# Altium schematic sheet 01_Overview.SchDoc
size A4
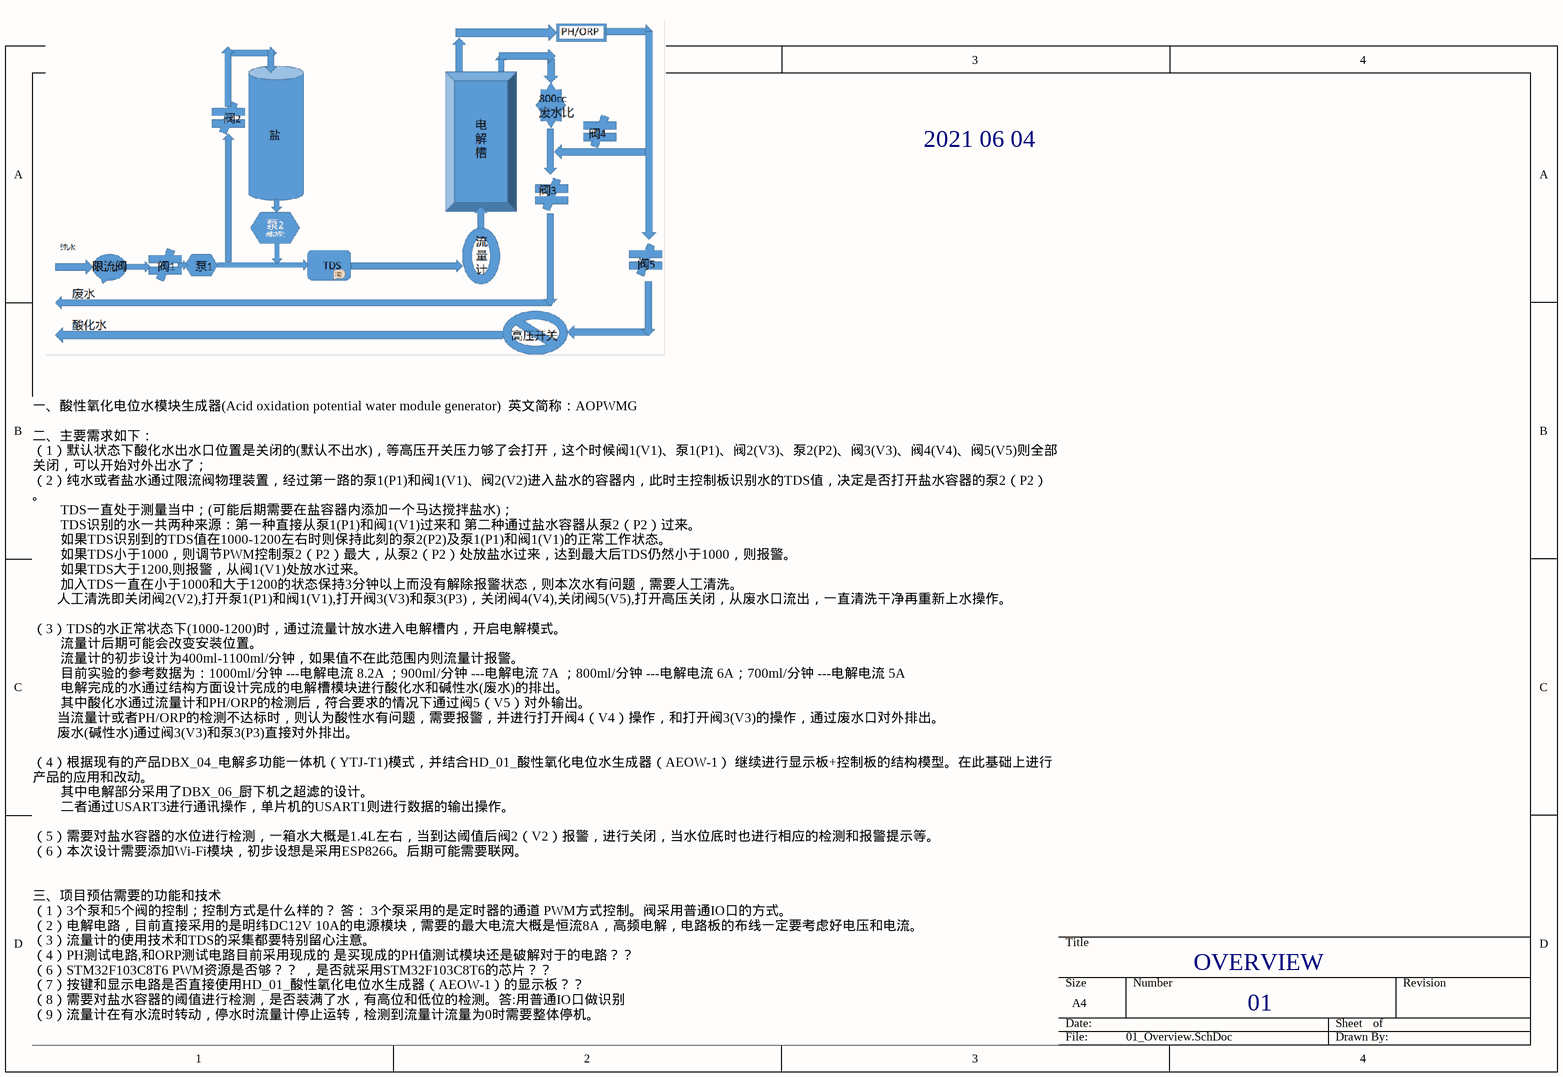
[diagram p0: 01_Overview.SchDoc]

## Notes on the sheet
- 2021 06 04
- OVERVIEW
- 01
- 一、酸性氧化电位水模块生成器(Acid oxidation potential water module generator)  英文简称：AOPWMG
  二、主要需求如下：
  （1）默认状态下酸化水出水口位置是关闭的(默认不出水)，等高压开关压力够了会打开，这个时候阀1(V1)、泵1(P1)、阀2(V3)、泵2(P2)、阀3(V3)、阀4(V4)、阀5(V5)则全部关闭，可以开始对外出水了；
  （2）纯水或者盐水通过限流阀物理装置，经过第一路的泵1(P1)和阀1(V1)、阀2(V2)进入盐水的容器内，此时主控制板识别水的TDS值，决定是否打开盐水容器的泵2（P2）。
  TDS一直处于测量当中；(可能后期需要在盐容器内添加一个马达搅拌盐水)；
  TDS识别的水一共两种来源：第一种直接从泵1(P1)和阀1(V1)过来和 第二种通过盐水容器从泵2（P2）过来。
  如果TDS识别到的TDS值在1000-1200左右时则保持此刻的泵2(P2)及泵1(P1)和阀1(V1)的正常工作状态。
  如果TDS小于1000，则调节PWM控制泵2（P2）最大，从泵2（P2）处放盐水过来，达到最大后TDS仍然小于1000，则报警。
  如果TDS大于1200,则报警，从阀1(V1)处放水过来。
  加入TDS一直在小于1000和大于1200的状态保持3分钟以上而没有解除报警状态，则本次水有问题，需要人工清洗。
  人工清洗即关闭阀2(V2),打开泵1(P1)和阀1(V1),打开阀3(V3)和泵3(P3)，关闭阀4(V4),关闭阀5(V5),打开高压关闭，从废水口流出，一直清洗干净再重新上水操作。
  （3）TDS的水正常状态下(1000-1200)时，通过流量计放水进入电解槽内，开启电解模式。
  流量计后期可能会改变安装位置。
  流量计的初步设计为400ml-1100ml/分钟，如果值不在此范围内则流量计报警。
  目前实验的参考数据为：1000ml/分钟 ---电解电流 8.2A ；900ml/分钟 ---电解电流 7A ；800ml/分钟 ---电解电流 6A；700ml/分钟 ---电解电流 5A
  电解完成的水通过结构方面设计完成的电解槽模块进行酸化水和碱性水(废水)的排出。
  其中酸化水通过流量计和PH/ORP的检测后，符合要求的情况下通过阀5（V5）对外输出。
  当流量计或者PH/ORP的检测不达标时，则认为酸性水有问题，需要报警，并进行打开阀4（V4）操作，和打开阀3(V3)的操作，通过废水口对外排出。
  废水(碱性水)通过阀3(V3)和泵3(P3)直接对外排出。
  （4）根据现有的产品DBX_04_电解多功能一体机（YTJ-T1)模式，并结合HD_01_酸性氧化电位水生成器（AEOW-1） 继续进行显示板+控制板的结构模型。在此基础上进行产品的应用和改动。
  其中电解部分采用了DBX_06_厨下机之超滤的设计。
  二者通过USART3进行通讯操作，单片机的USART1则进行数据的输出操作。
  （5）需要对盐水容器的水位进行检测，一箱水大概是1.4L左右，当到达阈值后阀2（V2）报警，进行关闭，当水位底时也进行相应的检测和报警提示等。
  （6）本次设计需要添加Wi-Fi模块，初步设想是采用ESP8266。后期可能需要联网。
  三、项目预估需要的功能和技术
  （1）3个泵和5个阀的控制；控制方式是什么样的？ 答： 3个泵采用的是定时器的通道 PWM方式控制。阀采用普通IO口的方式。
  （2）电解电路，目前直接采用的是明纬DC12V 10A的电源模块，需要的最大电流大概是恒流8A，高频电解，电路板的布线一定要考虑好电压和电流。
  （3）流量计的使用技术和TDS的采集都要特别留心注意。
  （4）PH测试电路,和ORP测试电路目前采用现成的 是买现成的PH值测试模块还是破解对于的电路？？
  （6）STM32F103C8T6 PWM资源是否够？？ ，是否就采用STM32F103C8T6的芯片？？
  （7）按键和显示电路是否直接使用HD_01_酸性氧化电位水生成器（AEOW-1）的显示板？？
  （8）需要对盐水容器的阈值进行检测，是否装满了水，有高位和低位的检测。答:用普通IO口做识别
  （9）流量计在有水流时转动，停水时流量计停止运转，检测到流量计流量为0时需要整体停机。